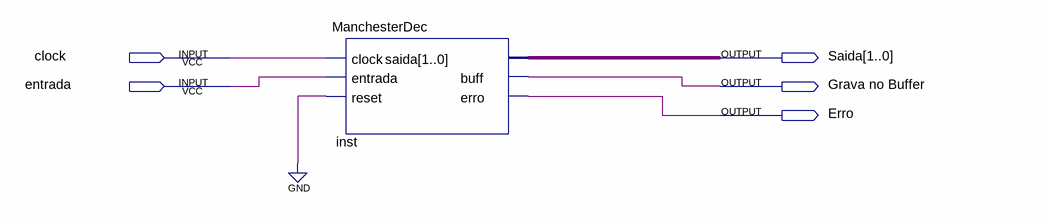
[diagram p0: schematic sheet]
// Quartus schematic Teste Man Dec.bdf as structural Verilog: 1 symbols, 5 pins
module \Teste_Man_Dec  (
  input  clock,
  input  entrada,
  output [1:0] Saida,
  output \Grava_no_Buffer ,
  output Erro
);

  ManchesterDec inst (
    .clock(clock), .entrada(entrada), .reset(1'b0), .saida(Saida), .buff(\Grava_no_Buffer ), .erro(Erro));
endmodule
